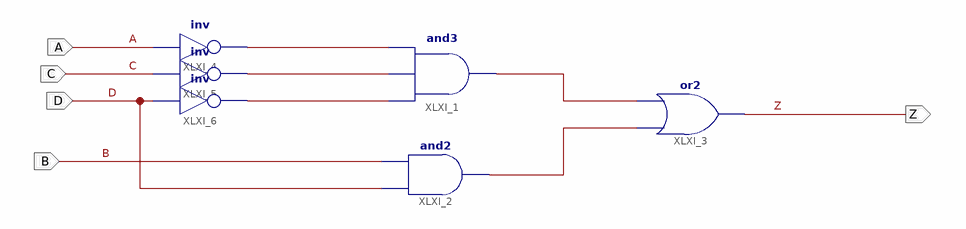
[diagram p0: schematic sheet 1]
// Xilinx ISE schematic p1ej1a.sch (spartan3) as structural Verilog: 6 symbols, 5 ports
module p1ej1a (
  input  D,
  input  C,
  input  A,
  input  B,
  output Z
);

  wire XLXN_1, XLXN_2, XLXN_3, XLXN_6, XLXN_7;

  and XLXI_1 (XLXN_7, XLXN_3, XLXN_2, XLXN_1);
  and XLXI_2 (XLXN_6, D, B);
  or XLXI_3 (Z, XLXN_6, XLXN_7);
  not XLXI_4 (XLXN_1, A);
  not XLXI_5 (XLXN_2, C);
  not XLXI_6 (XLXN_3, D);
endmodule
